# EAGLE design Schematics (EAGLE 7.6.0)
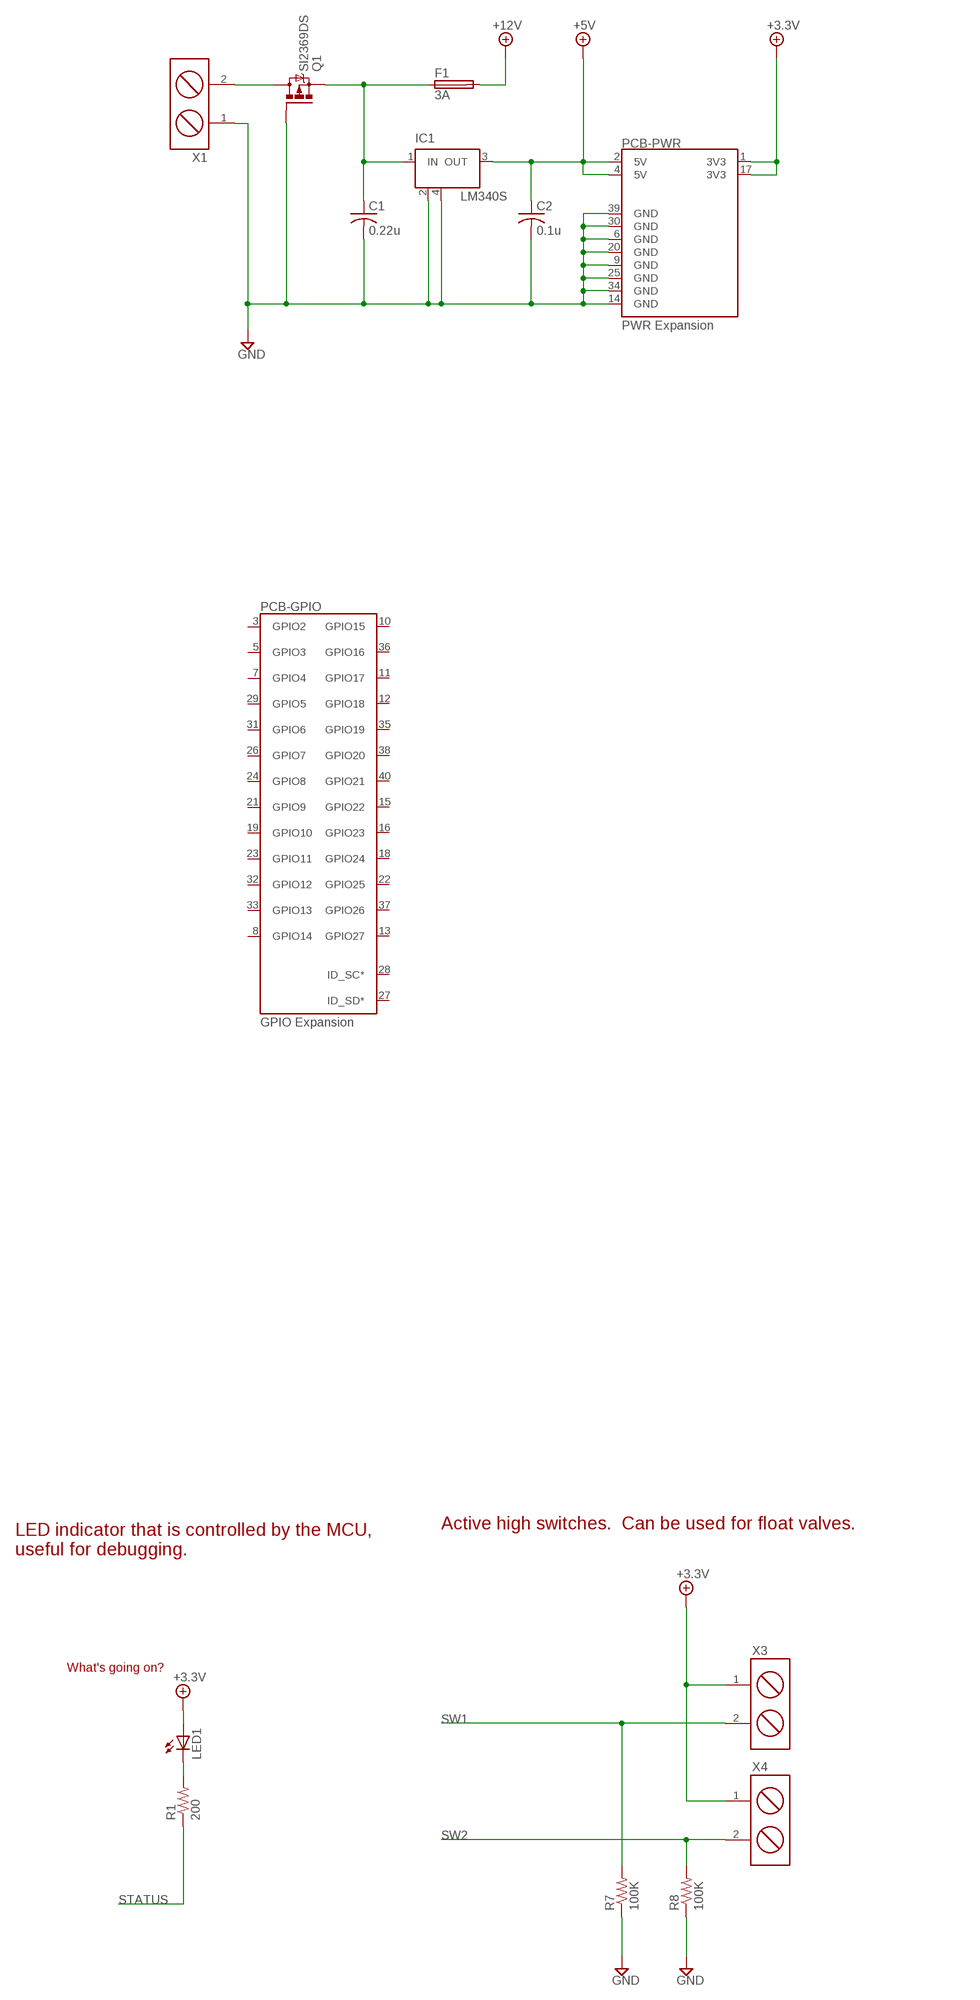
[diagram p0: schematic, sheet 1, part 1 of 2]
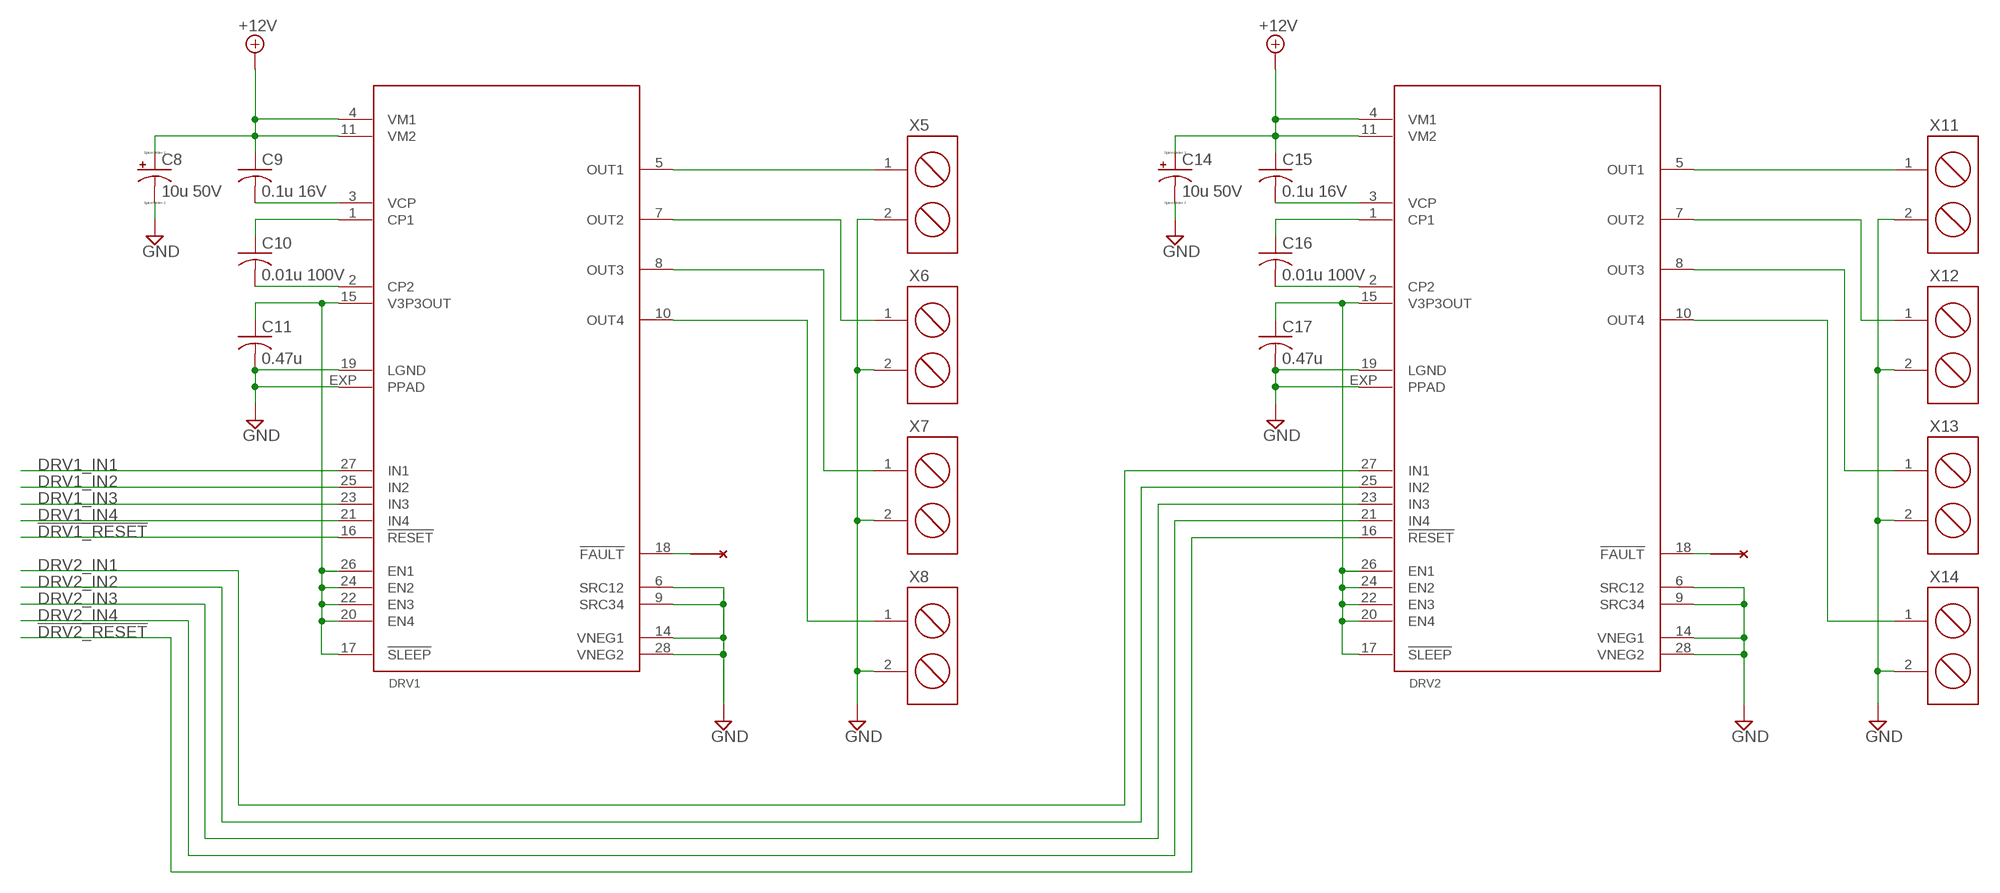
[diagram p1: schematic, sheet 1, part 2 of 2]

## Parts
C1  0.22u  C-USC0603  [C0603]
C2  0.1u  C-USC0603  [C0603]
C8  10u 50V  CPOL-USTAP5-50  [TAP5-50]
C9  0.1u 16V  C-USC0603  [C0603]
C10  0.01u 100V  C-USC0603  [C0603]
C11  0.47u  C-USC0603  [C0603]
C14  10u 50V  CPOL-USTAP5-50  [TAP5-50]
C15  0.1u 16V  C-USC0603  [C0603]
C16  0.01u 100V  C-USC0603  [C0603]
C17  0.47u  C-USC0603  [C0603]
DRV1  DRV8844  [HTSSOP28PWP]
DRV2  DRV8844  [HTSSOP28PWP]
F1  3A  0603SFP300F  [F0603]
IC1  LM340S  [SOT223]
LED1  LEDCHIP-LED0805  [CHIP-LED0805]
NC6  NC  (no package)
NC8  NC  (no package)
PCB  RPI3  [RPI3]
Q1  SI2369DS  [SOT23]
R1  200  R-US_R0603  [R0603]
R7  100K  R-US_R0603  [R0603]
R8  100K  R-US_R0603  [R0603]
X1  MPT2  [2POL254]
X3  MPT2  [2POL254]
X4  MPT2  [2POL254]
X5  MPT2  [2POL254]
X6  MPT2  [2POL254]
X7  MPT2  [2POL254]
X8  MPT2  [2POL254]
X11  MPT2  [2POL254]
X12  MPT2  [2POL254]
X13  MPT2  [2POL254]
X14  MPT2  [2POL254]

## Nets
!DRV1_RESET: DRV1.16(!RESET)
!DRV2_RESET: DRV2.16(!RESET)
+3P3V: LED1.A PCB.1(-PWR:3V3) PCB.17(-PWR:3V3) X3.1 X4.1 ; supply symbol labelled +3.3V
+5V: C2.1 IC1.3(OUT) PCB.2(-PWR:5V) PCB.4(-PWR:5V)
+12V: C8.+ C9.1 C14.+ C15.1 DRV1.4(VM1) DRV1.11(VM2) DRV2.4(VM1) DRV2.11(VM2) F1.2
DRV1_IN1: DRV1.27(IN1)
DRV1_IN2: DRV1.25(IN2)
DRV1_IN3: DRV1.23(IN3)
DRV1_IN4: DRV1.21(IN4)
DRV2_IN1: DRV2.27(IN1)
DRV2_IN2: DRV2.25(IN2)
DRV2_IN3: DRV2.23(IN3)
DRV2_IN4: DRV2.21(IN4)
GND: C1.2 C2.2 C8.- C11.2 C14.- C17.2 DRV1.6(SRC12) DRV1.9(SRC34) DRV1.14(VNEG1) DRV1.19(LGND) DRV1.28(VNEG2) DRV1.EXP(PPAD) DRV2.6(SRC12) DRV2.9(SRC34) DRV2.14(VNEG1) DRV2.19(LGND) DRV2.28(VNEG2) DRV2.EXP(PPAD) IC1.2(GND) IC1.4(GND) PCB.6(-PWR:GND) PCB.9(-PWR:GND) PCB.14(-PWR:GND) PCB.20(-PWR:GND) PCB.25(-PWR:GND) PCB.30(-PWR:GND) PCB.34(-PWR:GND) PCB.39(-PWR:GND) Q1.1(G) R7.1 R8.1 X1.1 X5.2 X6.2 X7.2 X8.2 X11.2 X12.2 X13.2 X14.2
N$10 [hv_pwr]: Q1.3(D) X1.2
N$13: C1.1 F1.1 IC1.1(IN) Q1.2(S)
N$22: DRV1.5(OUT1) X5.1
N$23: DRV1.7(OUT2) X6.1
N$24: DRV1.8(OUT3) X7.1
N$25: DRV1.10(OUT4) X8.1
N$26: C11.1 DRV1.15(V3P3OUT) DRV1.17(!SLEEP) DRV1.20(EN4) DRV1.22(EN3) DRV1.24(EN2) DRV1.26(EN1)
N$27: C10.2 DRV1.2(CP2)
N$28: C10.1 DRV1.1(CP1)
N$29: C9.2 DRV1.3(VCP)
N$30: DRV1.18(!FAULT) NC6.P$1
N$31: DRV2.5(OUT1) X11.1
N$32: DRV2.7(OUT2) X12.1
N$33: DRV2.8(OUT3) X13.1
N$34: DRV2.10(OUT4) X14.1
N$35: C17.1 DRV2.15(V3P3OUT) DRV2.17(!SLEEP) DRV2.20(EN4) DRV2.22(EN3) DRV2.24(EN2) DRV2.26(EN1)
N$39: LED1.C R1.2
N$41: C16.2 DRV2.2(CP2)
N$42: C16.1 DRV2.1(CP1)
N$43: C15.2 DRV2.3(VCP)
N$44: DRV2.18(!FAULT) NC8.P$1
STATUS: R1.1
SW1: R7.2 X3.2
SW2: R8.2 X4.2
Unconnected: PCB.3(-GPIO:GPIO2) PCB.5(-GPIO:GPIO3) PCB.7(-GPIO:GPIO4) PCB.8(-GPIO:GPIO14) PCB.10(-GPIO:GPIO15) PCB.11(-GPIO:GPIO17) PCB.12(-GPIO:GPIO18) PCB.13(-GPIO:GPIO27) PCB.15(-GPIO:GPIO22) PCB.16(-GPIO:GPIO23) PCB.18(-GPIO:GPIO24) PCB.19(-GPIO:GPIO10) PCB.21(-GPIO:GPIO9) PCB.22(-GPIO:GPIO25) PCB.23(-GPIO:GPIO11) PCB.24(-GPIO:GPIO8) PCB.26(-GPIO:GPIO7) PCB.27(-GPIO:ID_SD*) PCB.28(-GPIO:ID_SC*) PCB.29(-GPIO:GPIO5) PCB.31(-GPIO:GPIO6) PCB.32(-GPIO:GPIO12) PCB.33(-GPIO:GPIO13) PCB.35(-GPIO:GPIO19) PCB.36(-GPIO:GPIO16) PCB.37(-GPIO:GPIO26) PCB.38(-GPIO:GPIO20) PCB.40(-GPIO:GPIO21)

## Notes on the sheet
- Active high switches.  Can be used for float valves.
- LED indicator that is controlled by the MCU, 
  useful for debugging.
- What's going on?

## Library data of the parts
C1 C2 C9-C11 C15-C17 = resistor:C-US: CAPACITOR, American symbol
C8 C14 = resistor:CPOL-US: POLARIZED CAPACITOR, American symbol
DRV1 DRV2 = Common:DRV8844: RTD to Digital Converter The MAX31865 is a resistance-to-digital converter optimized for platinum resistance temperature detectors (RTDs). An external resistor sets the sensitivity for the RTD being used and a delta-sigma ADC converts the ratio of the RTD resistance to the reference resistance into digital form. The MAX31865’s inputs are protected against overvoltage faults up to +/-50V. Programmable detection of RTD and cable open and short conditions is included.
F1 = Common:0603SFP300F: Fuse
IC1 = linear:LM340S: 3-Terminal Positive Regulators Source: http://cache.national.com/ds/LM/LM340.pdf
LED1 = led:LED: LED OSRAM: - CHIPLED LG R971, LG N971, LY N971, LG Q971, LY Q971, LO R971, LY R971 LH N974, LH R974 LS Q976, LO Q976, LY Q976 LO Q996 - Hyper CHIPLED LW Q18S LB Q993, LB Q99A, LB R99A - SideLED LS A670, LO A670, LY A670, LG A670, LP A670 LB A673, LV A673, LT A673, LW A673 LH A674 LY A675 LS A676, LA A676, LO A676, LY A676, LW A676 LS A679, LY A679, LG A679 - Hyper Micro SIDELED® LS Y876, LA Y876, LO Y876, LY Y876 LT Y87S - SmartLED LW L88C, LW L88S LB L89C, LB L89S, LG L890 LS L89K, LO L89K, LY L89K LS L896, LA L896, LO L896, LY L896 - TOPLED LS T670, LO T670, LY T670, LG T670, LP T670 LSG T670, LSP T670, LSY T670, LOP T670, LYG T670 LG T671, LOG T671, LSG T671 LB T673, LV T673, LT T673, LW T673 LH T674 LS T676, LA T676, LO T676, LY T676, LB T676, LH T676, LSB T676, LW T676 LB T67C, LV T67C, LT T67C, LS T67K, LO T67K, LY T67K, LW E67C LS E67B, LA E67B, LO E67B, LY E67B, LB E67C, LV E67C, LT E67C LW T67C LS T679, LY T679, LG T679 LS T770, LO T770, LY T770, LG T770, LP T770 LB T773, LV T773, LT T773, LW T773 LH T774 LS E675, LA E675, LY E675, LS T675 LS T776, LA T776, LO T776, LY T776, LB T776 LHGB T686 LT T68C, LB T68C - Hyper Mini TOPLED® LB M676 - Mini TOPLED Santana® LG M470 LS M47K, LO M47K, LY M47K Source: http://www.osram.convergy.de LUXEON: - LUMILED® LXK2-PW12-R00, LXK2-PW12-S00, LXK2-PW14-U00, LXK2-PW14-V00 LXK2-PM12-R00, LXK2-PM12-S00, LXK2-PM14-U00 LXK2-PE12-Q00, LXK2-PE12-R00, LXK2-PE12-S00, LXK2-PE14-T00, LXK2-PE14-U00 LXK2-PB12-K00, LXK2-PB12-L00, LXK2-PB12-M00, LXK2-PB14-N00, LXK2-PB14-P00, LXK2-PB14-Q00 LXK2-PR12-L00, LXK2-PR12-M00, LXK2-PR14-Q00, LXK2-PR14-R00 LXK2-PD12-Q00, LXK2-PD12-R00, LXK2-PD12-S00 LXK2-PH12-R00, LXK2-PH12-S00 LXK2-PL12-P00, LXK2-PL12-Q00, LXK2-PL12-R00 Source: www.luxeon.com KINGBRIGHT: KA-3528ASYC Source: www.kingbright.com
NC6 NC8 = Common:NC: No Connect
PCB = Custom:RPI3: Raspberry Pi 3 expansion board.
Q1 = Common:SI2369DS: P-Channel 20-V (D-S) MOSFET Source: http://www.vishay.com/docs/72024/72024.pdf
R1 R7 R8 = resistor:R-US_: RESISTOR, American symbol
X1 X3-X8 X11-X14 = Common:MPT2: PHOENIX CONNECTOR

## Net classes
1 hv_pwr: width 0.813 mm, drill 0.508 mm, clearance 0.254 mm
2 lv_pwr: width 0.406 mm, drill 0.508 mm, clearance 0.254 mm
3 signal: width 0.254 mm, drill 0.254 mm, clearance 0.127 mm

## Board
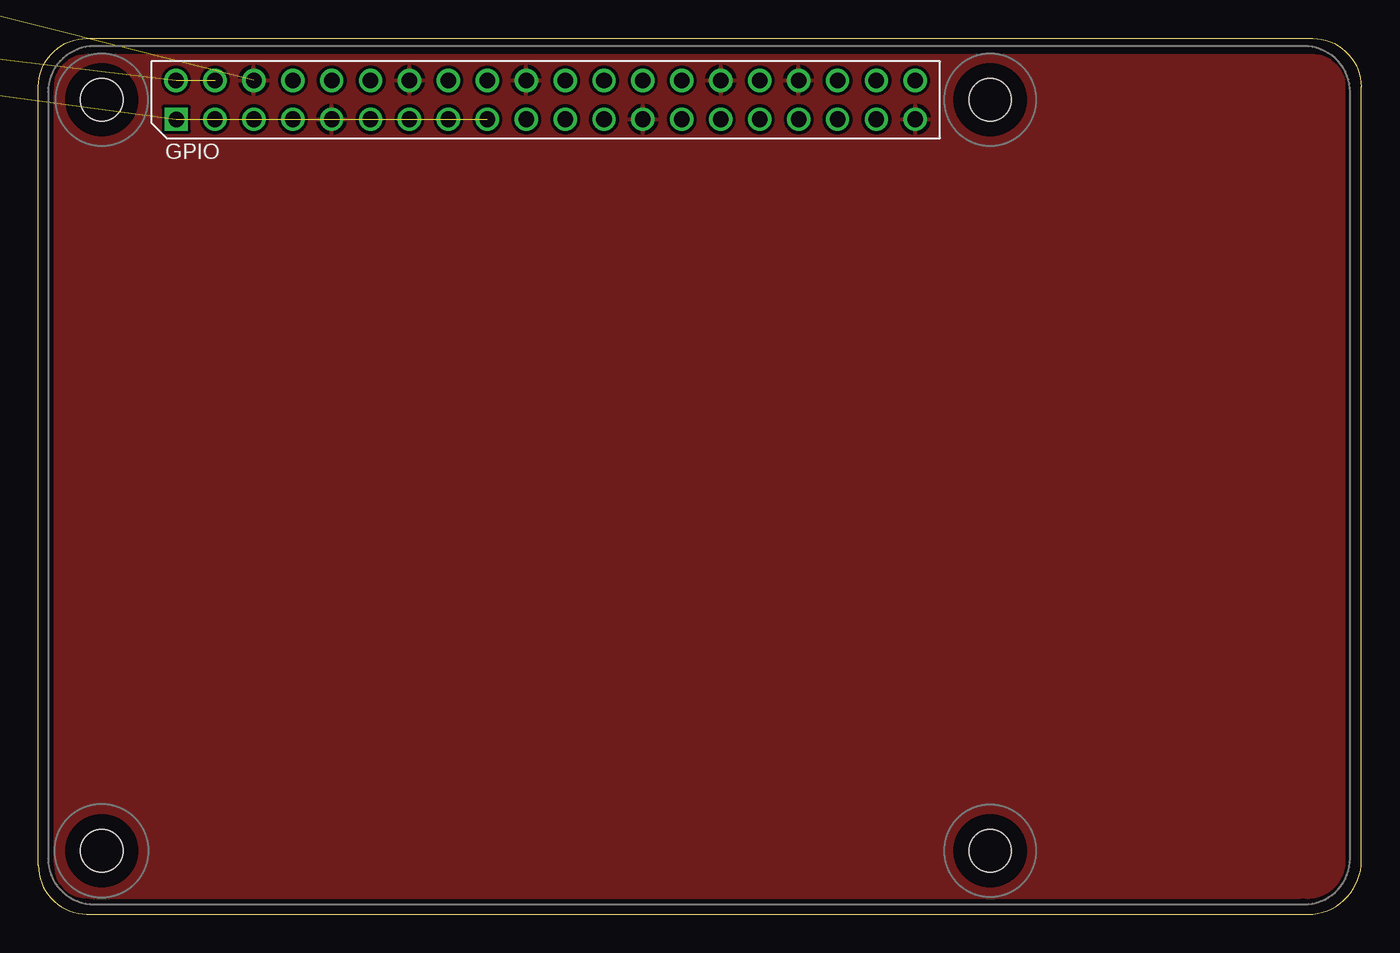
[diagram p2: board, top side]

Size 86.36 x 57.16 mm. Coordinates in mm from the lower left corner, seen from the top.
Outline: 0,3.19 0,53.99 arc-90 3.17,57.16 83.19,57.16 arc-90 86.36,53.99 86.36,3.19 arc-90 82.55,0.01 3.17,0.01 arc-90 0,3.19
Copper layers (1*16): Top 0.035mm / dielectric 1.5mm / Bottom 0.035mm
Design rules "default": minimum track width 10mil, minimum drill 24mil, track to track 8mil, track to pad 8mil, pad to pad 8mil, via to via 8mil, smd to smd 8mil, copper to edge 40mil, drill to drill 8mil, minimum pad ring 10mil, minimum via ring 8mil, stop-mask expansion 4mil, vias tented up to drill 0mil, thermal gap 10mil

### Footprints (pad centres in the part's own frame; a part is rotated, then mirrored left to right if it is on the bottom)
C0603 = smd 1.1 x 1: 1 -0.85,0; 2 0.85,0
TAP5-50 = drill 0.813: + -2.54,0 | drill 0.813 octagon: - 2.54,0
HTSSOP28PWP = smd 0.27 x 1.2: 1 -4.225,-2.9; 2 -3.575,-2.9; 3 -2.925,-2.9; 4 -2.275,-2.9; 5 -1.625,-2.9; 6 -0.975,-2.9; 7 -0.325,-2.9; 8 0.325,-2.9; 9 0.975,-2.9; 10 1.625,-2.9; 11 2.275,-2.9; 12 2.925,-2.9; 13 3.575,-2.9; 14 4.225,-2.9; 15 4.225,2.9; 16 3.575,2.9; 17 2.925,2.9; 18 2.275,2.9; 19 1.625,2.9; 20 0.975,2.9; 21 0.325,2.9; 22 -0.325,2.9; 23 -0.975,2.9; 24 -1.625,2.9; 25 -2.275,2.9; 26 -2.925,2.9; 27 -3.575,2.9; 28 -4.225,2.9 | smd 9.4 x 3: EXP 0,0
F0603 = smd 1 x 1.1: 1 -0.85,0; 2 0.85,0
SOT223 = smd 1.219 x 2.235: 1 -2.311,-3.099; 2 0,-3.099; 3 2.311,-3.099 | smd 3.6 x 2.2: 4 0,3.099
CHIP-LED0805 = smd 1.2 x 1.2: A 0,-1.05; C 0,1.05
RPI3 = drill 1.016 square: 1 8.37,51.23 | drill 1.016: 2 8.357,53.772; 3 10.897,51.232; 4 10.897,53.772; 5 13.437,51.232; 6 13.437,53.772; 7 15.977,51.232; 8 15.977,53.772; 9 18.517,51.232; 10 18.517,53.772; 11 21.057,51.232; 12 21.057,53.772; 13 23.597,51.232; 14 23.597,53.772; 15 26.137,51.232; 16 26.137,53.772; 17 28.677,51.232; 18 28.677,53.772; 19 31.217,51.232; 20 31.217,53.772; 21 33.757,51.232; 22 33.757,53.772; 23 36.297,51.232; 24 36.297,53.772; 25 38.837,51.232; 26 38.837,53.772; 27 41.377,51.232; 28 41.377,53.772; 29 43.917,51.232; 30 43.917,53.772; 31 46.457,51.232; 32 46.457,53.772; 33 48.997,51.232; 34 48.997,53.772; 35 51.537,51.232; 36 51.537,53.772; 37 54.077,51.232; 38 54.077,53.772; 39 56.617,51.232; 40 56.617,53.772 | hole 2.75: 3.5,3.5; 61.5,3.5; 3.5,52.5; 61.5,52.5
SOT23 = smd 1 x 1.4: 1 -0.95,-1.1; 2 0.95,-1.1; 3 0,1.1
R0603 = smd 1 x 1.1: 1 -0.85,0; 2 0.85,0
2POL254 = drill 1.2 long: 1 -1.27,0; 2 1.27,0

### Placement (x,y rotation side)
C1  -46.36,80.66 0 top  (outside the outline)
C2  -76.83,80.66 0 top  (outside the outline)
C8  -55.25,73.04 0 top  (outside the outline)
C9  -31.11,80.66 0 top  (outside the outline)
C10  -86.99,73.04 0 top  (outside the outline)
C11  -52.71,80.66 0 top  (outside the outline)
C14  -69.21,73.04 0 top  (outside the outline)
C15  -40.01,80.66 0 top  (outside the outline)
C16  -22.22,80.66 0 top  (outside the outline)
C17  -59.05,80.66 0 top  (outside the outline)
DRV1  -17.14,64.15 0 top  (outside the outline)
DRV2  -27.3,64.15 0 top  (outside the outline)
F1  -85.72,80.66 0 top  (outside the outline)
IC1  -37.47,62.88 0 top  (outside the outline)
LED1  -74.3,71.77 0 top  (outside the outline)
PCB  0.64,0.65 0 top
Q1  -48.9,62.88 0 top  (outside the outline)
R1  -81.91,80.66 0 top  (outside the outline)
R7  -65.41,80.66 0 top  (outside the outline)
R8  -71.75,80.66 0 top  (outside the outline)
X1  -55.25,61.61 0 top  (outside the outline)
X3  -61.59,61.61 0 top  (outside the outline)
X4  -67.94,61.61 0 top  (outside the outline)
X5  -74.3,61.61 0 top  (outside the outline)
X6  -80.64,61.61 0 top  (outside the outline)
X7  -86.99,61.61 0 top  (outside the outline)
X8  -15.88,74.31 0 top  (outside the outline)
X11  -22.22,74.31 0 top  (outside the outline)
X12  -28.57,74.31 0 top  (outside the outline)
X13  -34.93,74.31 0 top  (outside the outline)
X14  -41.27,74.31 0 top  (outside the outline)

### Tracks (layer width: path | path; a pad name or v marks a point on that pad's centre or on a via)
+3P3V  (4 unrouted)
+5V  (3 unrouted)
+12V  (8 unrouted)
GND  (32 unrouted)
  pour Top: -0.64,57.8 -0.64,-0.62 87,-0.62 87,3.19 87,56.53 87,57.8
N$10  (1 unrouted)
N$13  (3 unrouted)
N$22  (1 unrouted)
N$23  (1 unrouted)
N$24  (1 unrouted)
N$25  (1 unrouted)
N$26  (6 unrouted)
N$27  (1 unrouted)
N$28  (1 unrouted)
N$29  (1 unrouted)
N$31  (1 unrouted)
N$32  (1 unrouted)
N$33  (1 unrouted)
N$34  (1 unrouted)
N$35  (6 unrouted)
N$39  (1 unrouted)
N$41  (1 unrouted)
N$42  (1 unrouted)
N$43  (1 unrouted)
SW1  (1 unrouted)
SW2  (1 unrouted)